# Altium schematic sheet GL850G-SCH.SchDoc: GL850G-USB2.0-HUB
size A4; DrawnBy: veis; Revision: V1.0; SheetNumber: 1; SheetTotal: 1
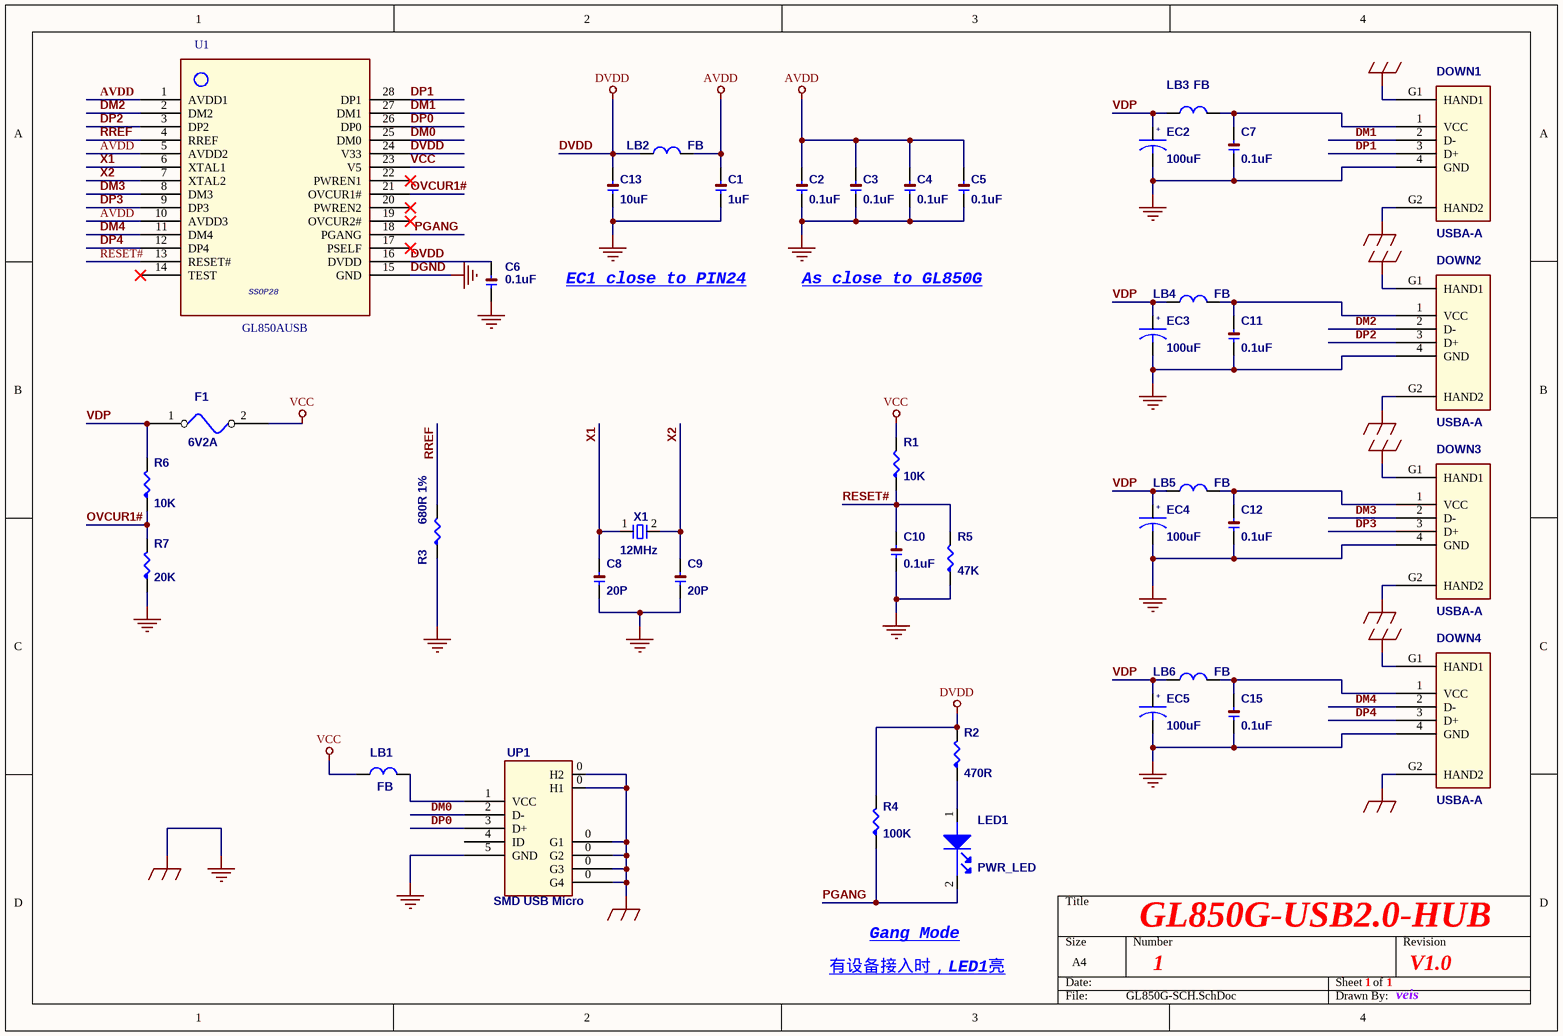
[diagram p0: GL850G-SCH.SchDoc]

## Parts
C1  1uF  [C0603]
C2  0.1uF  [C0603]
C3  0.1uF  [C0603]
C4  0.1uF  [C0603]
C5  0.1uF  [C0603]
C6  0.1uF  [C0603]
C7  0.1uF  [C0603]
C8  20P  [C0603]
C9  20P  [C0603]
C10  0.1uF  [C0603]
C11  0.1uF  [C0603]
C12  0.1uF  [C0603]
C13  10uF  [C0603]
C15  0.1uF  [C0603]
DOWN1  USBA-A  [USBA-A]
DOWN2  USBA-A  [USBA-A]
DOWN3  USBA-A  [USBA-A]
DOWN4  USBA-A  [USBA-A]
EC2  100uF  [CED-6_3-2_5]
EC3  100uF  [CED-6_3-2_5]
EC4  100uF  [CED-6_3-2_5]
EC5  100uF  [CED-6_3-2_5]
F1  6V2A  [1210l]
LB1  FB  [L0805]
LB2  FB  [L0805]
LB3  FB  [L0805]
LB4  FB  [L0805]
LB5  FB  [L0805]
LB6  FB  [L0805]
LED1  PWR_LED  [LED_0603]
R1  10K  [R0603]
R2  470R  [R0603]
R3  680R 1%  [R0603]
R4  100K  [R0603]
R5  47K  [R0603]
R6  10K  [R0603]
R7  20K  [R0603]
U1  GL850AUSB  [SSOP28]
UP1  SMD USB Micro  [Micro_USB_MK5P]
X1  12MHz  [XTAL-49SMA-H4.2]

## Nets
AVDD: C1.2 C2.2 C3.2 C4.2 C5.2 LB2.1 U1.1(AVDD1) U1.5(AVDD2) U1.10(AVDD3)
DGND: C1.1 C2.1 C3.1 C4.1 C5.1 C6.1 C7.1 C8.1 C9.1 C10.1 C11.1 C12.1 C13.1 C15.1 DOWN1.4(GND) DOWN1.G1(HAND1) DOWN1.G2(HAND2) DOWN2.4(GND) DOWN2.G1(HAND1) DOWN2.G2(HAND2) DOWN3.4(GND) DOWN3.G1(HAND1) DOWN3.G2(HAND2) DOWN4.4(GND) DOWN4.G1(HAND1) DOWN4.G2(HAND2) EC2.2 EC3.2 EC4.2 EC5.2 R3.1 R5.1 R7.1 U1.15(GND) UP1.0(G1) UP1.5(GND)  [also labelled EGND]
DVDD: C6.2 C13.2 LB2.2 R2.2 R4.2 U1.16(DVDD) U1.24(V33)
VCC: F1.2 LB1.1 R1.2 U1.23(V5)
DM0: U1.25(DM0) UP1.2(D-)
DM1: DOWN1.2(D-) U1.27(DM1)
DM2: DOWN2.2(D-) U1.2(DM2)
DM3: DOWN3.2(D-) U1.8(DM3)
DM4: DOWN4.2(D-) U1.11(DM4)
DP0: U1.26(DP0) UP1.3(D+)
DP1: DOWN1.3(D+) U1.28(DP1)
DP2: DOWN2.3(D+) U1.3(DP2)
DP3: DOWN3.3(D+) U1.9(DP3)
DP4: DOWN4.3(D+) U1.12(DP4)
OVCUR1#: R6.1 R7.2 U1.21(OVCUR1#)
PGANG: LED1.2 R4.1 U1.18(PGANG)
RESET#: C10.2 R1.1 R5.2 U1.13(RESET#)
RREF: R3.2 U1.4(RREF)
VDP: EC2.1 EC3.1 EC4.1 EC5.1 F1.1 LB3.1 LB4.2 LB5.2 LB6.2 R6.2
X1: C8.2 U1.6(XTAL1) X1.1
X2: C9.2 U1.7(XTAL2) X1.2
NetC7_2: C7.2 DOWN1.1(VCC) LB3.2
NetC11_2: C11.2 DOWN2.1(VCC) LB4.1
NetC12_2: C12.2 DOWN3.1(VCC) LB5.1
NetC15_2: C15.2 DOWN4.1(VCC) LB6.1
NetLB1_2: LB1.2 UP1.1(VCC)
NetLED1_1: LED1.1 R2.1

Not connected (* = marked no-connect by the designer): U1 14(TEST)* 17(PSELF)* 19(OVCUR2#)* 20(PWREN2)* 22(PWREN1)*; UP1 4(ID)

## Notes on the sheet
- EC1 close to PIN24
- As close to GL850G
- 有设备接入时，LED1亮
- (near LED1) Gang Mode
- (in symbol CE-100UF/16V) +
- (in symbol GLI8024-48_3) SSOP28

## Library data of the parts
C1-C13 C15 = C-0603
EC2-EC5 = CE-100UF/16V
F1 = FS-A_0
LB1-LB6 = FB-0805
LED1 = LED-3mm_0
R1 R2 R4-R7 = R-0603
R3 = R-0603 1%
U1 = GLI8024-48_3
UP1 = CNS-USBminiAB-A
X1 = XD-49US-A